# Altium schematic sheet RF.SchDoc
size A4
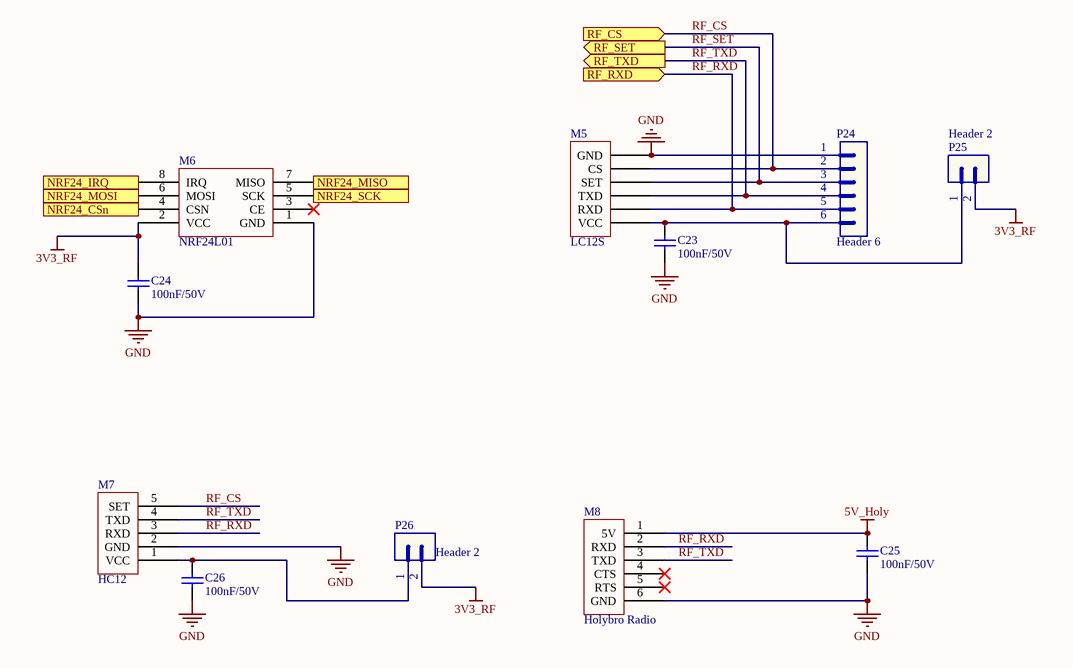
[diagram p0: RF.SchDoc]

## Parts
C23  value 100nF/50V  [CAP-SM-0805]  (hidden comment: Cap-100nF-50V-0805)
C24  value 100nF/50V  [CAP-SM-0805]  (hidden comment: Cap-100nF-50V-0805)
C25  value 100nF/50V  [CAP-SM-0805]  (hidden comment: Cap-100nF-50V-0805)
C26  value 100nF/50V  [CAP-SM-0805]  (hidden comment: Cap-100nF-50V-0805)
M5  LC12S  [LC12S]
M6  NRF24L01  [NRF24L01]
M7  HC12  [HC12]
M8  Holybro Radio  [Holybro-RADIO]
P24  Header 6  [JP6]
P25  Header 2  [JP2]
P26  Header 2  [JP2]

## Ports
NRF24_CSn (in), NRF24_IRQ (out), NRF24_MISO (out), NRF24_MOSI (in), NRF24_SCK (in), RF_CS (in), RF_RXD (in), RF_SET (out), RF_TXD (out)

## Nets
3V3_RF: C24.2 M6.2(VCC) P25.2 P26.2
5V_Holy: C25.2 M8.1(5V)
GND: C23.1 C24.1 C25.1 C26.1 M5.6(GND) M6.1(GND) M7.2(GND) M8.6(GND) P24.1
NRF24_CSn: M6.4(CSN) ; port NRF24_CSn
NRF24_IRQ: M6.8(IRQ) ; port NRF24_IRQ
NRF24_MISO: M6.7(MISO) ; port NRF24_MISO
NRF24_MOSI: M6.6(MOSI) ; port NRF24_MOSI
NRF24_SCK: M6.5(SCK) ; port NRF24_SCK
RF_CS: M5.5(CS) M7.5(SET) P24.2 ; port RF_CS
RF_RXD: M5.2(RXD) M7.3(RXD) M8.2(RXD) P24.5 ; port RF_RXD
RF_SET: M5.4(SET) P24.3 ; port RF_SET
RF_TXD: M5.3(TXD) M7.4(TXD) M8.3(TXD) P24.4 ; port RF_TXD
NetC23_2: C23.2 M5.1(VCC) P24.6 P25.1
NetC26_2: C26.2 M7.1(VCC) P26.1

Not connected (* = marked no-connect by the designer): M6 3(CE)*; M8 4(CTS)* 5(RTS)*

## Library data of the parts
C23-C26 = Cap-100nF-50V-0805: CAP CER 0.1UF 50V Y5V 0805; Manufacturer: Samsung Electro-Mechanics; Manufacturer Part Number: CL21F104ZBCNNNC; Local Supplier: thegioiic; Local Supplier Link: https://thegioiic.com/products/tu-100nf-0-1uf-50v-0805; Supplier 1: Digikey; Supplier 1 Part Number: 1276-1007-1-ND; Supplier 1 Link: https://www.digikey.com/product-detail/en/samsung-electro-mechanics/CL21F104ZBCNNNC/1276-1007-1-ND/3889093
P24 = Header 6: Header, 6-Pin; LatestRevisionDate: 17-Jul-2002; LatestRevisionNote: Re-released for DXP Platform.; Publisher: Altium Limited
P25 P26 = Header 2: Header, 2-Pin; LatestRevisionDate: 17-Jul-2002; LatestRevisionNote: Re-released for DXP Platform.; Publisher: Altium Limited
M5 = LC12S: Local Supplier: HShop; Local Supplier Link: https://hshop.vn/products/mach-thu-phat-rf-uart-lc12s-2-4ghz?fbclid=IwAR26O0qUYvAaxZyOD_fV7zzf2od6t2O22eUH8MkuJUU9SmcdCCf5BpKqTRM; Local Supplier Part Number: HS000895; Manufacturer: *; Manufacturer Part Number: *
M6 = NRF24L01: Local Supplier: HShop; Local Supplier Link: https://hshop.vn/products/mach-thu-phat-rf-nrf24l01-pa-lna-nrf-e04; Local Supplier Part Number: HS000888; Manufacturer: *; Manufacturer Part Number: *
M7 = HC12: Local Supplier: HShop; Local Supplier Link: https://hshop.vn/products/mach-thu-phat-rf-uart-si4463-433mhzkhoang-coch-1km; Local Supplier Part Number: HS000897; Manufacturer: *; Manufacturer Part Number: *
M8 = Holybro Radio: Local Supplier: HShop; Local Supplier Link: *; Local Supplier Part Number: *; Manufacturer: *; Manufacturer Part Number: *